# Altium schematic sheet SH1 - CONNECTORS AND POWER.SchDoc: Connectors and Power
size B; CheckedBy: Lance Bantoto; Engineer: Kyle Hong; Revision: 2; SheetNumber: 1; SheetTotal: 2
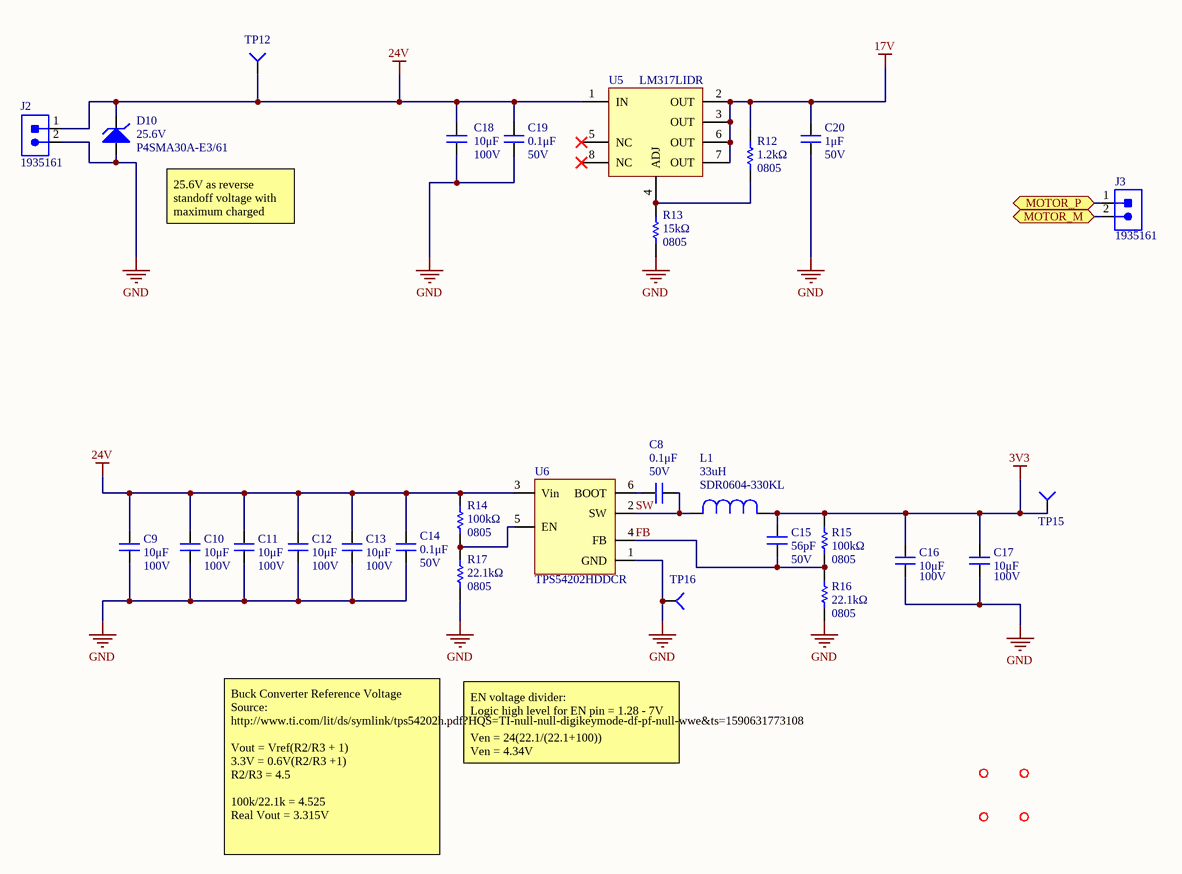
[diagram p0: SH1 - CONNECTORS AND POWER.SchDoc]

## Parts
C8  Voltage Rating: 50V  [CAP2012]  (hidden comment: 0.1μF)
C9  value 10μF  Voltage Rating: 100V  [CAP1210]  (hidden comment: CAP_10uF_100V_1210)
C10  value 10μF  Voltage Rating: 100V  [CAP1210]  (hidden comment: CAP_10uF_100V_1210)
C11  value 10μF  Voltage Rating: 100V  [CAP1210]  (hidden comment: CAP_10uF_100V_1210)
C12  value 10μF  Voltage Rating: 100V  [CAP1210]  (hidden comment: CAP_10uF_100V_1210)
C13  value 10μF  Voltage Rating: 100V  [CAP1210]  (hidden comment: CAP_10uF_100V_1210)
C14  Voltage Rating: 50V  [CAP2012]  (hidden comment: 0.1μF)
C15  value 56pF  Voltage Rating: 50V  [CAP2012]  (hidden comment: CAP_56pF_50V_0805)
C16  value 10μF  Voltage Rating: 100V  [CAP1210]  (hidden comment: CAP_10uF_100V_1210)
C17  value 10μF  Voltage Rating: 100V  [CAP1210]  (hidden comment: CAP_10uF_100V_1210)
C18  value 10μF  Voltage Rating: 100V  [CAP1210]  (hidden comment: CAP_10uF_100V_1210)
C19  Voltage Rating: 50V  [CAP2012]  (hidden comment: 0.1μF)
C20  value 1μF  Voltage Rating: 50V  [CAP2012]  (hidden comment: CAP_1uF_50V_0805)
D10  Reverse Standoff Voltage: 25.6V  [DO-214AC_UNI]  (hidden comment: P4SMA30A-E3/61)
J2  1935161  [1935161]
J3  1935161  [1935161]
L1  Manufacturer Part Number 1: SDR0604-330KL  Inductance: 33uH  [IND_BOURNS_SDR0604]  (hidden comment: IND_33uH_880mA)
MH1  MOUNTING_HOLES  [MOUNTING_HOLE]  (value not drawn)
MH2  MOUNTING_HOLES  [MOUNTING_HOLE]  (value not drawn)
MH3  MOUNTING_HOLES  [MOUNTING_HOLE]  (value not drawn)
MH4  MOUNTING_HOLES  [MOUNTING_HOLE]  (value not drawn)
R12  value 1.2kΩ  Case Code (Imperial): 0805  [RESC2012X60N]  (hidden comment: RES_1.2kΩ_0805)
R13  value 15kΩ  Case Code (Imperial): 0805  [RESC2012X60N]  (hidden comment: RES_15Ω_0805)
R14  Case Code (Imperial): 0805  Resistance: 100kΩ  [RESC2012X60N]  (hidden comment: RES_100kΩ_0805)
R15  Case Code (Imperial): 0805  Resistance: 100kΩ  [RESC2012X60N]  (hidden comment: RES_100kΩ_0805)
R16  Case Code (Imperial): 0805  Resistance: 22.1kΩ  [RESC2012X60N]  (hidden comment: RES_22.1kΩ_0805)
R17  Case Code (Imperial): 0805  Resistance: 22.1kΩ  [RESC2012X60N]  (hidden comment: RES_22.1kΩ_0805)
TP12  TESTPOINT_SMD_LOOP  [S1751-46R]  (value not drawn)
TP15  TESTPOINT_SMD_LOOP  [S1751-46R]  (value not drawn)
TP16  TESTPOINT_SMD_LOOP  [S1751-46R]  (value not drawn)
U5  LM317LIDR  [LM317LIDR]
U6  TPS54202HDDCR  [SOT23-6]

## Ports
MOTOR_M (bidir), MOTOR_P (bidir)

## Nets
3V3: C15.2 C16.2 C17.2 L1.1 R15.2 TP15.1(=value)
17V: C20.2 R12.2 U5.2(OUT) U5.3(OUT) U5.6(OUT) U5.7(OUT)
24V: C9.2 C10.2 C11.2 C12.2 C13.2 C14.2 C18.2 C19.2 D10.2 J2.1 R14.2 TP12.1(=value) U5.1(IN) U6.3(Vin)
GND: C9.1 C10.1 C11.1 C12.1 C13.1 C14.1 C16.1 C17.1 C18.1 C19.1 C20.1 D10.1 J2.2 R13.1 R16.1 R17.1 TP16.1(=value) U6.1(GND)
FB: C15.1 R15.1 R16.2 U6.4(FB)
MOTOR_M: J3.2 ; port MOTOR_M
MOTOR_P: J3.1 ; port MOTOR_P
SW: C8.2 L1.2 U6.2(SW)
NetC8_1: C8.1 U6.6(BOOT)
NetR12_1: R12.1 R13.2 U5.4(ADJ)
NetR14_1: R14.1 R17.2 U6.5(EN)

Not connected (* = marked no-connect by the designer): U5 5(NC)* 8(NC)*

## Notes on the sheet
- 25.6V as reverse standoff voltage with maximum charged condition in mind
- EN voltage divider:
  Logic high level for EN pin = 1.28 - 7V
  Ven = 24(22.1/(22.1+100))
  Ven = 4.34V
- Buck Converter Reference Voltage
  Source: http://www.ti.com/lit/ds/symlink/tps54202h.pdf?HQS=TI-null-null-digikeymode-df-pf-null-wwe&ts=1590631773108
  Vout = Vref(R2/R3 + 1)
  3.3V = 0.6V(R2/R3 +1)
  R2/R3 = 4.5
  100k/22.1k = 4.525
  Real Vout = 3.315V
- Title:
- Project:
- Date:
- Rev:
- Checker:
- Engineer:
- Sheet:
- of

## Library data of the parts
C8 C14 C19 = CAP_0.1uF_50V_0805: CAP CER 0.1UF 50V X7R 0805; Manufacturer 1: Murata Electronics; Manufacturer Part Number 1: GCD21BR71H104KA01L; Tolerance: 10%; Mount: Surface Mount; Case Code (Metric): 2012; Case Code (Imperial): 0805; Min Operating Temperature: -55°C; Max Operating Temperature: 125°C; Dielectric: X7R; Termination: SMD/SMT; Length: 2mm; Height: 1.25mm; Width: 0.049inch; Thickness: 0.049inch; Depth: 1.25mm; Ratings: AEC-Q200; Supplier 1: Digi-Key; Supplier Part Number 1: 490-11955-1-ND; Value: 0.1μF; Package: 0805 (2012 Metric)
C9-C13 C16-C18 = CAP_10uF_100V_1210: CAP CER 10uF 100V X7S 10% 1210; Manufacturer 1: Murata; Manufacturer Part Number 1: GRM32EC72A106KE05L; Supplier 1: Digi-Key; Category: Ceramic Capacitors; Mount: Surface Mount; Case Code (Imperial): 1210; Case Code (Metric): 3225; Min Operating Temperature: -55°C; Max Operating Temperature: 125°C; Tolerance: 10%; Supplier Part Number 1: 490-16266-1-ND; Package: 1210 (3225 Metric); Dielectric: X7S
C15 = CAP_56pF_50V_0805: CAP CER 56PF 50V C0G/NP0; Manufacturer 1: Yageo; Manufacturer Part Number 1: CC0805FRNPO9BN560; Dielectric: C0G, NP0; Tolerance: 1%; Supplier 1: Digi-Key; Category: Ceramic Capacitors; Mount: Surface Mount; Weight: 0.000194oz; Case Code (Metric): 2012; Case Code (Imperial): 0805; Min Operating Temperature: -55°C; Max Operating Temperature: 125°C; Termination: SMD/SMT; Composition: Ceramic; Voltage Rating (DC): 50V; Length: 2mm; Height: 0.6mm; Depth: 1.25mm; Width: 0.049inch; Thickness: 0.028inch; Supplier Part Number 1: 311-4179-1-ND; Package: 0805 (2012 Metric)
C20 = CAP_1uF_50V_0805: CAP CER 1UF 50V X7R 0805; Manufacturer Part Number 1: CL21B105KBFNNNG; Manufacturer 1: Samsung Electro-Mechanics; Tolerane: ±10%; Package: 0805; Supplier Part Number 1: 1276-6470-1-ND; Supplier 1: Digi-Key; Mount: Surface Mount; Temperature Coefficient: X7R
D10 = P4SMA30A-E3/61: TVS DIODE, 400W, 25.6V, UNI, DO-214AC; Manufacturer 1: Vishay Semiconductors; Element Configuration: Single; Leakage Current: 1uA; Direction: Unidirectional; Reverse Breakdown Voltage: 28.5V; Max Surge Current: 40A; Number of Unidirectional Channels: 1; Clamping Voltage: 41.4V; Power Line Protection: No; Test Current: 1mA; Peak Pulse Current: 9.7A; Supplier 1: Digi-Key; Category: TVS Diodes; Mount: Surface Mount; Case/Package: SMA; Number of Pins: 2; Min Operating Temperature: -65°C; Max Operating Temperature: 150°C; Max Power Dissipation: 400W; Composition: Zener; Operating Supply Voltage: 25.6V; Polarity: Unidirectional; Min Breakdown Voltage: 28.5V; Peak Pulse Power: 400W; Breakdown Voltage: 28.5V; Number of Channels: 1; Max Reverse Leakage Current: 1uA; Number of Elements: 1; Supplier Part Number 1: P4SMA30A-E3/61GICT-ND; Manufacturer Part Number 1: P4SMA30A-E3/61
J2 J3 = CON_2M_TERM: TERM BLK 2POS SIDE ENTRY 5MM; Manufacturer 1: Phoenix Contact; Connector Type: Screw; Voltage Rating (DC): 320V; Max Current Rating: 16A; Max Supply Voltage: 250V; Current Rating: 17.5A; Number of Poles: 2; Number of Levels: 1; Current: 18A; Voltage: 300V; Wire Gauge (Max): 26AWG; Wire Gauge (Min): 12AWG; Approvals: UL; Supplier 1: Digi-Key; Mount: Through Hole; Number of Pins: 2; Weight: 0.067021oz; Contact Material: Copper,Tin; Insulation Material: Nylon; Housing Material: Polyamide; Housing Color: Green; Color: Green; Material: Nylon; Number of Rows: 1; Voltage Rating: 250V; Number of Positions: 2; Number of Positions Per Level: 2; Termination: Solder; Number of Contacts: 2; Number of Circuits: 2; Orientation: Straight; Length: 9mm; Height: 11.3mm; Width: 14.9mm; Pitch: 5mm; Depth: 9mm; Wire/Cable Gauge: 26AWG; Flammability Rating: UL94 V-0; REACH SVHC: Unknown; Supplier Part Number 1: 277-1667-ND; Manufacturer Part Number 1: 1935161
L1 = IND_33uH_880mA: IND, 33uH, 10%, 1 Element, Ferrite-Core, SMD; Manufacturer 1: Bourns; Max DC Current: 880mA; DC Resistance (DCR): 250mR; Test Frequency: 1kHz; Q Factor: 24; Self Resonant Frequency: 13MHz; Saturation Current: 1.1A; Shielding: Unshielded; Supplier 1: Digi-Key; Category: Fixed Inductors; Mount: Surface Mount; Case/Package: Nonstandard; Number of Pins: 2; Core Material: Ferrite; Min Operating Temperature: -40°C; Max Operating Temperature: 125°C; Tolerance: 10%; Termination: SMD/SMT; Composition: Wirewound; RMS Current (Irms): 880mA; DC Current: 880mA; Military Standard: Not; Resistance: 250MR; Inductance Tolerance: 10%; Current Rating: 880mA; Diameter: 5.8mm; Length: 0.228inch; Height: 4.8mm; Height - Seated (Max): 0.189inch; Width: 0.228inch; REACH SVHC: No SVHC; ComponentLink7URL: https://datasheet.ciiva.com/6689/sdr0604-6689450.pdf?src-supplier=Digi-Key; ComponentLink7Description: https://datasheet.ciiva.com/6689/sdr0604-6689450.pdf?src-supplier=Digi-Key; ComponentLink8URL: https://datasheet.ciiva.com/8515/sdr0604-8515983.pdf?src-supplier=Avnet; ComponentLink8Description: https://datasheet.ciiva.com/8515/sdr0604-8515983.pdf?src-supplier=Avnet; Supplier Part Number 1: SDR0604-330KLCT-ND
MH1-MH4 = MOUNTING_HOLES: 6cm x 6cm
R12 = RES_1.2kΩ_0805_1%: RES 1.2K OHM 1% 1/8W 0805 /; Manufacturer 1: Stackpole Electronics Inc; Manufacturer Part Number 1: RMCF0805FT1K20; Case Code (Metric): 0805; Tolerance: 1%; Mount: Surface Mount; Supplier Part Number 1: RMCF0805FT1K20CT-ND; Supplier 1: Digi-Key
R13 = RES_15kΩ_0805_1%: RES 15K OHM 1% 1/8W 0805 /; Manufacturer 1: Vishay Dale; Manufacturer Part Number 1: CRCW080515K0FKEA; Case Code (Metric): 0805; Tolerance: 1%; Mount: Surface Mount; Supplier Part Number 1: 541-15.0KCCT-ND; Supplier 1: Digi-Key
R14 R15 = RES_100kΩ_0805_0.5%: RES 100K OHM 0.5% 1/8W 0805; Manufacturer 1: Panasonic; Manufacturer Part Number 1: ERA-6AED104V; Power Rating: 125mW; Temperature Coefficient: 25ppm/°C; Voltage Rating: 200V; Supplier 1: Digi-Key; Category: Chip SMD Resistors; Mount: Surface Mount; Case Code (Metric): 2012; Contact Plating: Tin; Min Operating Temperature: -55°C; Max Operating Temperature: 155°C; Composition: Thin Film; Termination: SMD/SMT; Military Standard: Not; Length: 2mm; Height: 0.5mm; Depth: 1.25mm; Width: 1.25mm; Supplier Part Number 1: P123795CT-ND; Tolerance: 0.5%; Package: 0805 (2012 Metric)
R16 R17 = RES_22.1kΩ_0805_1%: RES 22.1K OHM 1% 1/8W 0805; Manufacturer 1: Vishay Dale; Manufacturer Part Number 1: CRCW080522K1FKEA; Power Rating: 125mW; Supplier 1: Digi-Key; Case Code (Metric): 2012; Min Operating Temperature: -55°C; Max Operating Temperature: 155°C; Tolerance: 1%; Termination: SMD/SMT; Supplier Part Number 1: 541-22.1KCCT-ND; Package: 0805 (2012 Metric)
TP12 TP15 TP16 = TESTPOINT_SMD_LOOP: PC TEST POINT SMD; Manufacturer 1: Harwin; Plating: Tin; Number of Ports: 1; Supplier 1: Digi-Key; Manufacturer Part Number 1: S1751-46R; RoHS: Yes; Category: Terminal Blocks; Stock 1: 159143; Pricing 1: 1=0.29000, 10=0.27700, 25=0.23760, 50=0.20200, 100=0.19400, 250=0.17424, 500=0.16632, 1000=0.13860 (USD); Mount: Surface Mount; Material: Brass,Copper Alloy; Contact Material: Copper,Copper Alloy; Contact Plating: Tin; Color: Natural; Termination: Solder; Orientation: Straight; Number of Contacts: 1; Package Quantity: 2500; Packaging: Tape and Reel; Length: 3.25mm; Height: 2mm; Depth: 2mm; Width: 1.65mm; Radiation Hardening: No; REACH SVHC: No SVHC; ComponentLink1URL: https://datasheet.ciiva.com:443/pdfs/VipMasterIC/IC/HRWN/HRWN-S-A0002541722/HRWN-S-A0004513972-1.pdf?src-supplier=IHS+Markit; ComponentLink1Description: https://datasheet.ciiva.com:443/pdfs/VipMasterIC/IC/HRWN/HRWN-S-A0002541722/HRWN-S-A0004513972-1.pdf?src-supplier=IHS+Markit; ComponentLink2URL: https://datasheet.ciiva.com/5224/2010page161-58228-5224784.pdf?src-supplier=Mouser; ComponentLink2Description: https://datasheet.ciiva.com/5224/2010page161-58228-5224784.pdf?src-supplier=Mouser; ComponentLink3URL: https://datasheet.ciiva.com/22631/1688119-22631153.pdf?src-supplier=Element14; ComponentLink3Description: https://datasheet.ciiva.com/22631/1688119-22631153.pdf?src-supplier=Element14; ComponentLink4URL: https://datasheet.ciiva.com/2917/s1751-2917604.pdf?src-supplier=Digi-Key; ComponentLink4Description: https://datasheet.ciiva.com/2917/s1751-2917604.pdf?src-supplier=Digi-Key; ComponentLink5URL: https://datasheet.ciiva.com/1462/1693781-1462652.pdf?src-supplier=Farnell; ComponentLink5Description: https://datasheet.ciiva.com/1462/1693781-1462652.pdf?src-supplier=Farnell; ComponentLink6URL: https://datasheet.ciiva.com/1454/1693781-1454941.pdf?src-supplier=Element14; ComponentLink6Description: https://datasheet.ciiva.com/1454/1693781-1454941.pdf?src-supplier=Element14; Supplier Part Number 1: 952-1478-1-ND
U5 = LDO_ADJ_100mA: IC REG LIN POS ADJ 100MA 8SOIC; Manufacturer 1: Texas Instruments; PSRR: 80dB ~ 65dB (120Hz); Voltage - Input (Max): 38V; Voltage - Output (Min/Fixed): 1.2V; Voltage - Output (Max): 32V; Current - Output: 100mA; Operating Temperature: -40C = 125C; Mounting Type: Surface Mount; Supplier 1: Digi-Key; Supplier Part Number 1: 296-20678-1-ND; Manufacturer Part Number 1: LM317LIDR
U6 = TPS54202HDDCR: IC REG BUCK ADJ 2A TSOT23-6; Manufacturer 1: Texas Instruments; Output Type: Adjustable; Output Configuration: Positive; Number of Outputs: 1; Min Input Voltage: 4.5V; Max Input Voltage: 28V; Min Output Voltage: 596mV; Switching Frequency: 500kHz; Synchronous Rectifier: Yes; Quiescent Current: 40uA; Supplier 1: Digi-Key; Category: Voltage Regulators - Switching; Mount: Surface Mount; Case/Package: SOT-23-6; Min Operating Temperature: -40°C; Max Operating Temperature: 125°C; Max Output Voltage: 28V; Output Current: 2A; Supplier Part Number 1: 296-44396-1-ND; Manufacturer Part Number 1: TPS54202HDDCR